# EasyEDA schematic DPUNK-Schematic.json
TITLE: D-Punk (Discrete-Atari-Punk); REV: 4; Date: 2023-11-10; Sheet: 1/1; Drawn By: Joel Eagles; Company: Eagles Electric
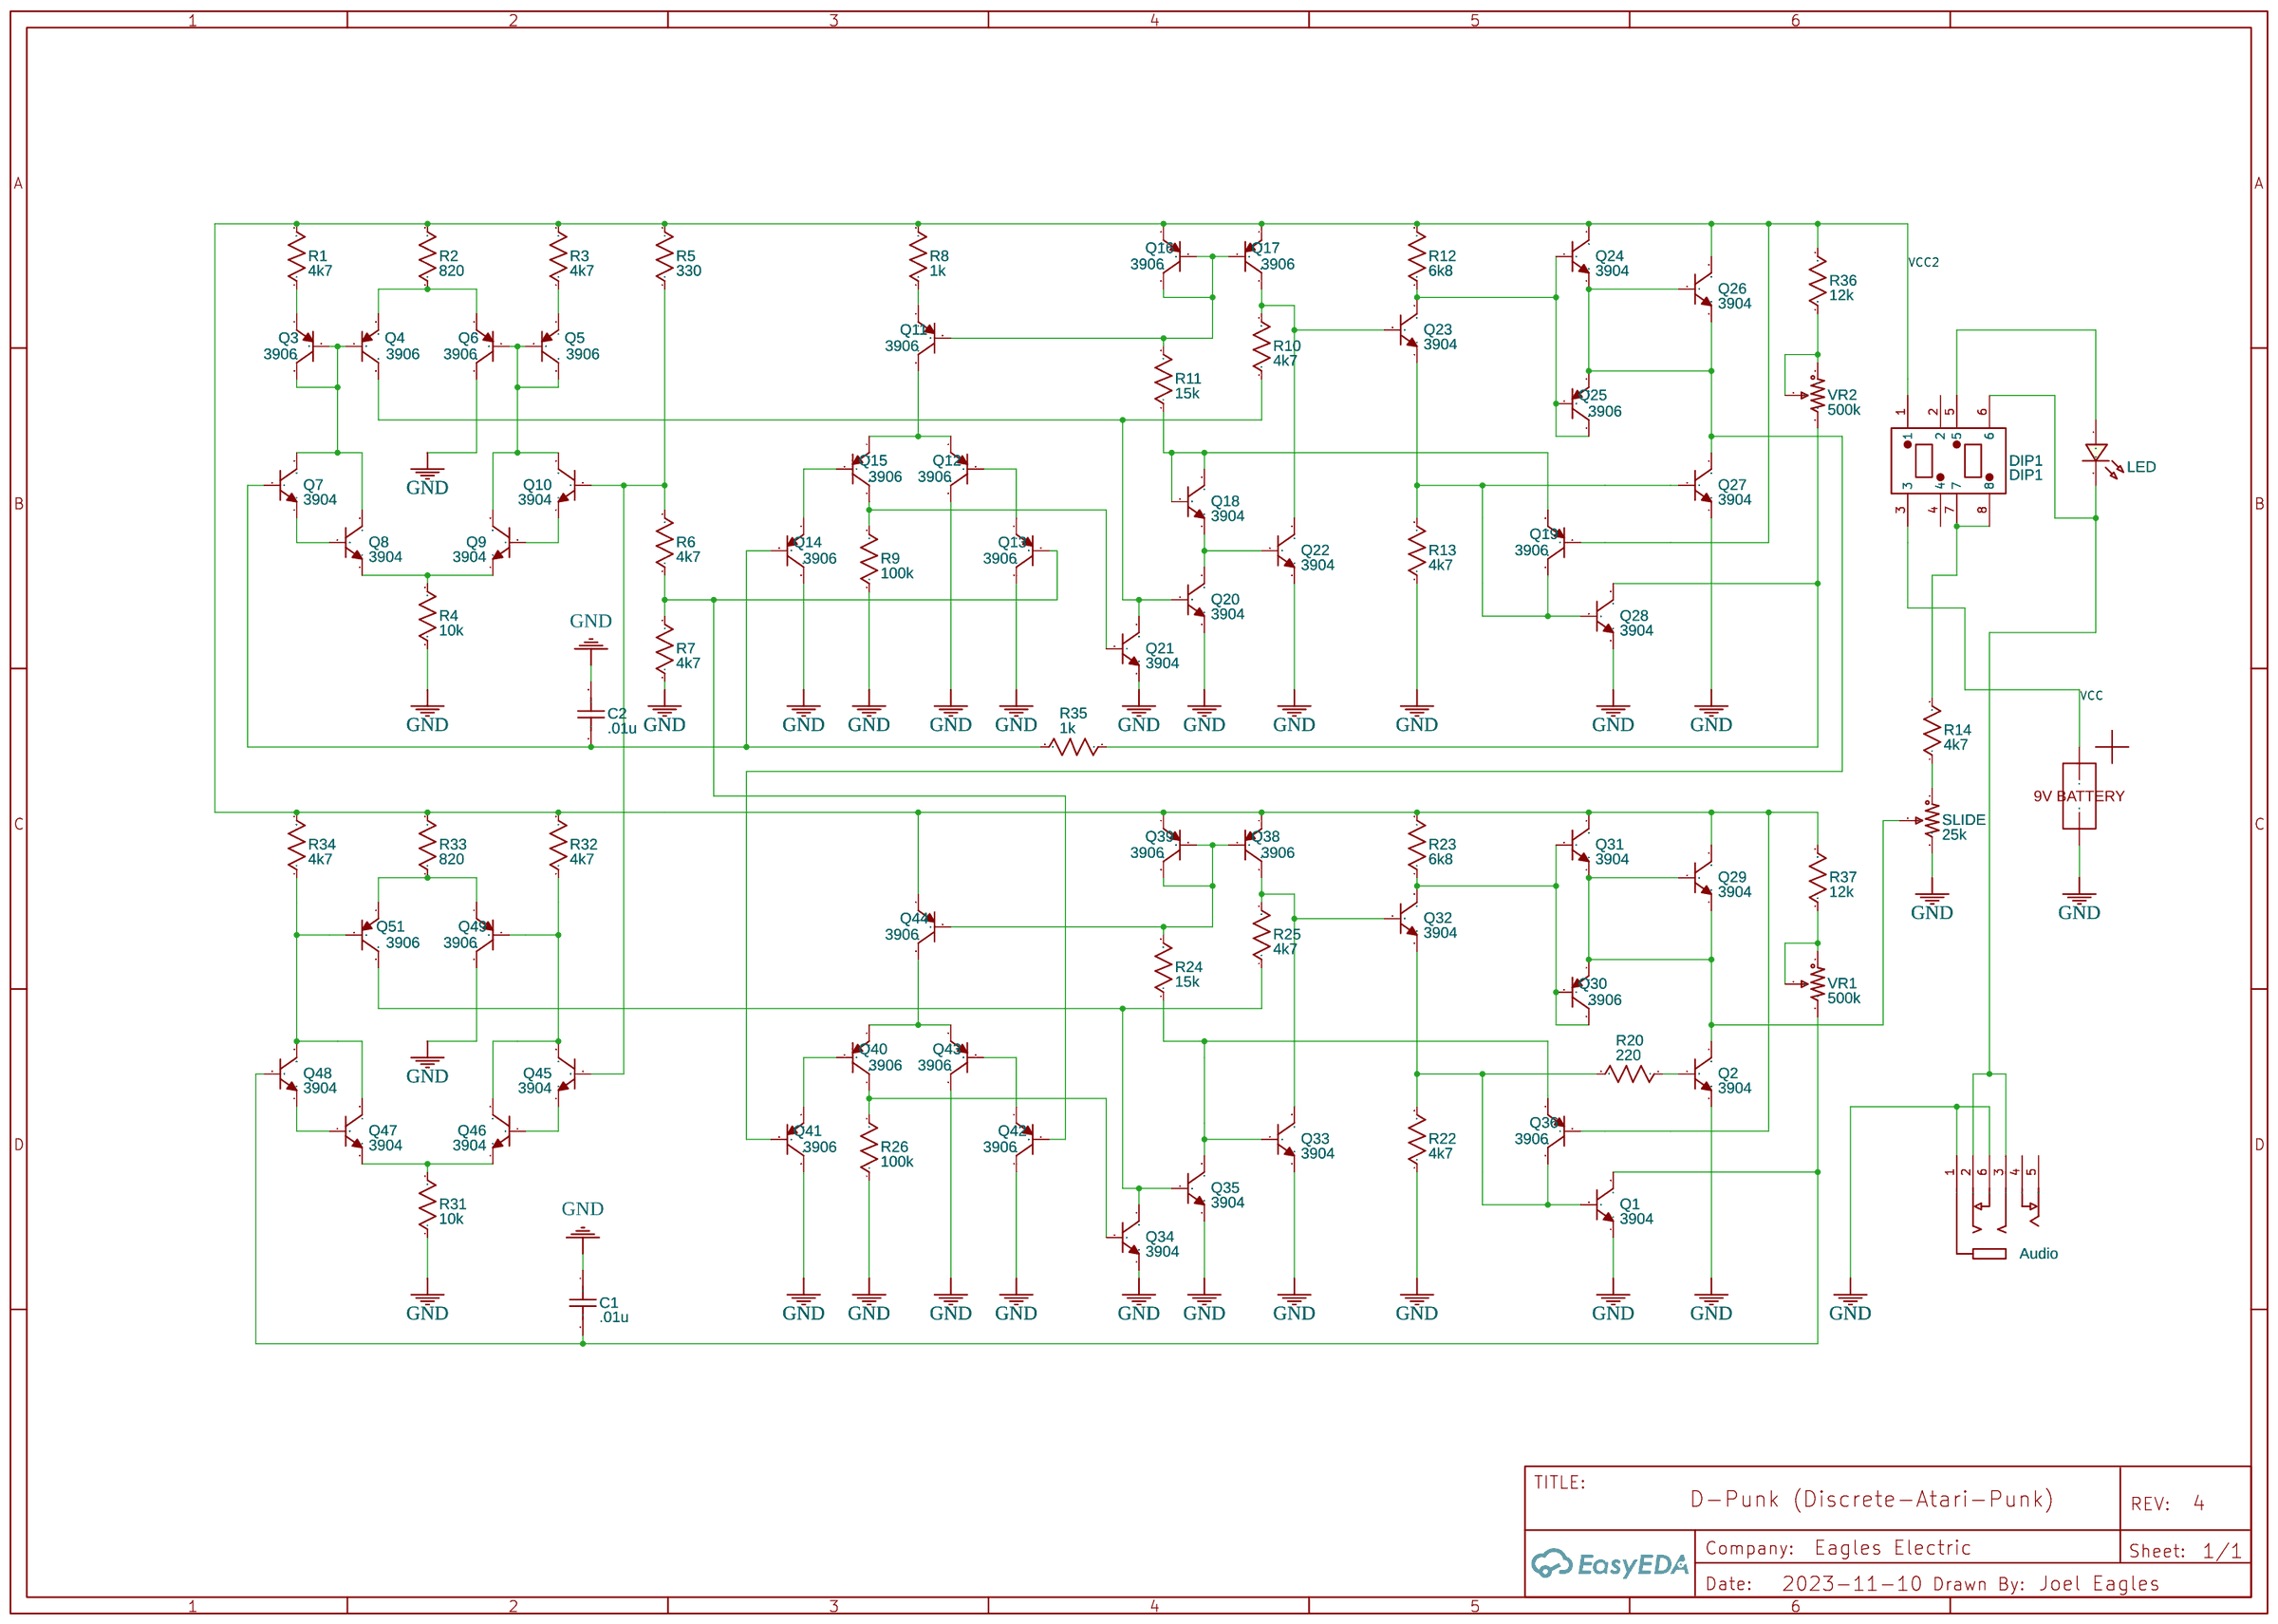
[diagram p0: schematic sheet]

## Parts
9V  9v battery connector  [9V BATTERY]
AUX  Audio  [AUDIO-JACK-1]
C1  .01u  [CERAMIC CAPACITOR]
C2  .01u  [CERAMIC CAPACITOR]
DIP1  DIP1  [78J02T INVIS]
LED  LED  [LED-TH_BD5.0_RED]
Q1  3904  [2NBJT]
Q2  3904  [2NBJT]
Q3  3906  [2NBJT]
Q4  3906  [2NBJT]
Q5  3906  [2NBJT]
Q6  3906  [2NBJT]
Q7  3904  [2NBJT]
Q8  3904  [2NBJT]
Q9  3904  [2NBJT]
Q10  3904  [2NBJT]
Q11  3906  [2NBJT]
Q12  3906  [2NBJT]
Q13  3906  [2NBJT]
Q14  3906  [2NBJT]
Q15  3906  [2NBJT]
Q16  3906  [2NBJT]
Q17  3906  [2NBJT]
Q18  3904  [2NBJT]
Q19  3906  [2NBJT]
Q20  3904  [2NBJT]
Q21  3904  [2NBJT]
Q22  3904  [2NBJT]
Q23  3904  [2NBJT]
Q24  3904  [2NBJT]
Q25  3906  [2NBJT]
Q26  3904  [2NBJT]
Q27  3904  [2NBJT]
Q28  3904  [2NBJT]
Q29  3904  [2NBJT]
Q30  3906  [2NBJT]
Q31  3904  [2NBJT]
Q32  3904  [2NBJT]
Q33  3904  [2NBJT]
Q34  3904  [2NBJT]
Q35  3904  [2NBJT]
Q36  3906  [2NBJT]
Q38  3906  [2NBJT]
Q39  3906  [2NBJT]
Q40  3906  [2NBJT]
Q41  3906  [2NBJT]
Q42  3906  [2NBJT]
Q43  3906  [2NBJT]
Q44  3906  [2NBJT]
Q45  3904  [2NBJT]
Q46  3904  [2NBJT]
Q47  3904  [2NBJT]
Q48  3904  [2NBJT]
Q49  3906  [2NBJT]
Q51  3906  [2NBJT]
R1  4k7  [R_AXIAL-0.4]
R2  820  [R_AXIAL-0.4]
R3  4k7  [R_AXIAL-0.4]
R4  10k  [R_AXIAL-0.4]
R5  330  [R_AXIAL-0.4]
R6  4k7  [R_AXIAL-0.4]
R7  4k7  [R_AXIAL-0.4]
R8  1k  [R_AXIAL-0.4]
R9  100k  [R_AXIAL-0.4]
R10  4k7  [R_AXIAL-0.4]
R11  15k  [R_AXIAL-0.4]
R12  6k8  [R_AXIAL-0.4]
R13  4k7  [R_AXIAL-0.4]
R14  4k7  [R_AXIAL-0.4]
R20  220  [R_AXIAL-0.4]
R22  4k7  [R_AXIAL-0.4]
R23  6k8  [R_AXIAL-0.4]
R24  15k  [R_AXIAL-0.4]
R25  4k7  [R_AXIAL-0.4]
R26  100k  [R_AXIAL-0.4]
R31  10k  [R_AXIAL-0.4]
R32  4k7  [R_AXIAL-0.4]
R33  820  [R_AXIAL-0.4]
R34  4k7  [R_AXIAL-0.4]
R35  1k  [R_AXIAL-0.4]
R36  12k  [R_AXIAL-0.4]
R37  12k  [R_AXIAL-0.4]
SLIDE  25k  [PTA3043]
VR1  500k  [ADAFRUIT POTENTIOMETER]
VR2  500k  [ADAFRUIT POTENTIOMETER]

## Library data of the parts
9V = 9v battery connector: Contributor: joeleagles; Package Display: Yes
AUX = ASJ-99H-R-HT-T/R: Manufacturer: ADAM TECH; Contributor: Luis Garbanzo; Package Display: No
C1 C2 = C_0603_US: Contributor: LCEDA_Lib
DIP1 = 78J02T: Manufacturer: Grayhill; Supplier: Mouser; Supplier Part: 706-78J02T; link: https://eu.mouser.com/ProductDetail/Grayhill/78J02T?qs=ls7QRyWmRk5lRQ%252bisZPK0A%3D%3D; Contributor: megagulper1
LED = LED-TH-5mm_R: Manufacturer: EVERLIGHT(台湾亿光); Manufacturer Part: 333-2SURD/S530-A3; Supplier Part: C87271; Supplier: LCSC; Contributor: LCEDA_Lib; Package Display: No
Q1 Q2 Q7-Q10 Q18 Q20-Q24 Q26-Q29 Q31-Q35 Q45-Q48 = 2N3904(TO-92): Supplier: LCSC; Manufacturer: SEMTECH; Manufacturer Part: 2N3904; Supplier Part: C118538; Contributor: LCEDA_Lib
Q3-Q6 Q11-Q17 Q19 Q25 Q30 Q36 Q38-Q44 Q49 Q51 = 2N3906(TO-92): Supplier: LCSC; Manufacturer: CJ; Manufacturer Part: 2N3906; Supplier Part: C9809; Contributor: LCEDA_Lib
R1-R14 R20 R22-R26 R31-R37 = R_AXIAL-0.4_US: Contributor: LCEDA_Lib
SLIDE VR1 VR2 = R_3386P_US: Supplier: LCSC; Contributor: LCEDA_Lib; value(Ω): 10K

## Nets
GND: 9V.2 AUX.1(2) AUX.6(7) C1.1 C2.2 Q1.1(E) Q2.1(E) Q6.3(C) Q12.3(C) Q13.3(C) Q14.3(C) Q20.1(E) Q21.1(E) Q22.1(E) Q27.1(E) Q28.1(E) Q33.1(E) Q34.1(E) Q35.1(E) Q41.3(C) Q42.3(C) Q43.3(C) Q49.3(C) R4.1 R7.1 R9.1 R13.1 R22.1 R26.1 R31.1 SLIDE.3
VCC: 9V.1 DIP1.3
VCC2: DIP1.1 Q16.1(E) Q17.1(E) Q19.2(B) Q24.3(C) Q26.3(C) Q29.3(C) Q31.3(C) Q36.2(B) Q38.1(E) Q39.1(E) Q44.1(E) R1.2 R2.2 R3.2 R5.2 R8.2 R12.2 R23.2 R32.2 R33.2 R34.2 R36.2 R37.2
Net-(AUX-2): AUX.2(3) AUX.3(4) DIP1.6 LED.2
Net-(C1-2): C1.2 Q1.3(C) Q48.2(B) VR1.3
Net-(C2-1): C2.1 Q7.2(B) Q14.2(B) R35.2
Net-(DIP1-5): DIP1.5 LED.1
Net-(DIP1-7): DIP1.7 DIP1.8 R14.2
Net-(Q1-2): Q1.2(B) Q32.1(E) Q36.3(C) R20.2 R22.2
Net-(Q2-2): Q2.2(B) R20.1
Net-(Q2-3): Q2.3(C) Q29.1(E) Q29.2(B) Q30.1(E) Q31.1(E) SLIDE.2
Net-(Q3-1): Q3.1(E) R1.1
Net-(Q3-2): Q3.2(B) Q3.3(C) Q4.2(B) Q7.3(C) Q8.3(C)
Net-(Q4-1): Q4.1(E) Q6.1(E) R2.1
Net-(Q4-3): Q4.3(C) Q20.2(B) Q21.3(C) R10.1
Net-(Q5-1): Q5.1(E) R3.1
Net-(Q5-2): Q5.2(B) Q5.3(C) Q6.2(B) Q9.3(C) Q10.3(C)
Net-(Q7-1): Q7.1(E) Q8.2(B)
Net-(Q8-1): Q8.1(E) Q9.1(E) R4.2
Net-(Q9-2): Q9.2(B) Q10.1(E)
Net-(Q10-2): Q10.2(B) Q45.2(B) R5.1 R6.2
Net-(Q11-1): Q11.1(E) R8.1
Net-(Q11-2): Q11.2(B) Q16.2(B) Q16.3(C) Q17.2(B) R11.2
Net-(Q11-3): Q11.3(C) Q12.1(E) Q15.1(E)
Net-(Q12-2): Q12.2(B) Q13.1(E)
Net-(Q13-2): Q13.2(B) Q42.2(B) R6.1 R7.2
Net-(Q14-1): Q14.1(E) Q15.2(B)
Net-(Q15-3): Q15.3(C) Q21.2(B) R9.2
Net-(Q17-3): Q17.3(C) Q22.3(C) Q23.2(B) R10.2
Net-(Q18-1): Q18.1(E) Q20.3(C) Q22.2(B)
Net-(Q18-2): Q18.2(B) Q18.3(C) Q19.1(E) R11.1
Net-(Q19-3): Q19.3(C) Q23.1(E) Q27.2(B) Q28.2(B) R13.2
Net-(Q23-3): Q23.3(C) Q24.2(B) Q25.2(B) Q25.3(C) R12.1
Net-(Q24-1): Q24.1(E) Q25.1(E) Q26.1(E) Q26.2(B) Q27.3(C) Q41.2(B)
Net-(Q28-3): Q28.3(C) R35.1 VR2.3
Net-(Q30-2): Q30.2(B) Q30.3(C) Q31.2(B) Q32.3(C) R23.1
Net-(Q32-2): Q32.2(B) Q33.3(C) Q38.3(C) R25.2
Net-(Q33-2): Q33.2(B) Q35.3(C) Q36.1(E) R24.1
Net-(Q34-2): Q34.2(B) Q40.3(C) R26.2
Net-(Q34-3): Q34.3(C) Q35.2(B) Q51.3(C) R25.1
Net-(Q38-2): Q38.2(B) Q39.2(B) Q39.3(C) Q44.2(B) R24.2
Net-(Q40-1): Q40.1(E) Q43.1(E) Q44.3(C)
Net-(Q40-2): Q40.2(B) Q41.1(E)
Net-(Q42-1): Q42.1(E) Q43.2(B)
Net-(Q45-1): Q45.1(E) Q46.2(B)
Net-(Q45-3): Q45.3(C) Q46.3(C) Q49.2(B) R32.1
Net-(Q46-1): Q46.1(E) Q47.1(E) R31.2
Net-(Q47-2): Q47.2(B) Q48.1(E)
Net-(Q47-3): Q47.3(C) Q48.3(C) Q51.2(B) R34.1
Net-(Q49-1): Q49.1(E) Q51.1(E) R33.1
Net-(R14-1): R14.1 SLIDE.1
Net-(R36-1): R36.1 VR2.1 VR2.2
Net-(R37-1): R37.1 VR1.1 VR1.2

Not connected (* = marked no-connect by the designer): AUX 4(5) 5(6); DIP1 2 4
